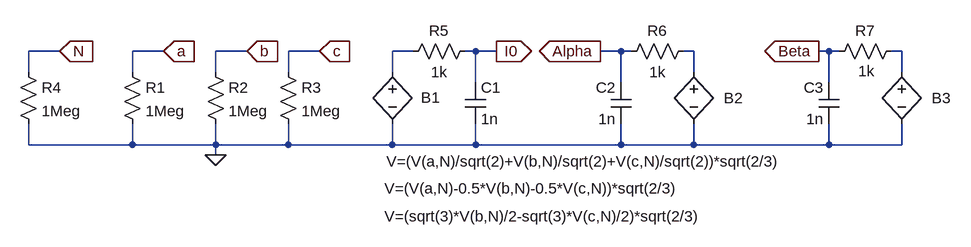
[diagram p0: schematic abc_alpha_beta.asc]
abc_alpha_beta.asc, the LTspice schematic file:
Version 4.1
SHEET 1 1696 680
WIRE -432 16 -480 16
WIRE -272 16 -320 16
WIRE -144 16 -192 16
WIRE -32 16 -80 16
WIRE 112 16 80 16
WIRE 208 16 192 16
WIRE 240 16 208 16
WIRE 432 16 400 16
WIRE 448 16 432 16
WIRE 544 16 528 16
WIRE 752 16 736 16
WIRE 768 16 752 16
WIRE 864 16 848 16
WIRE -480 48 -480 16
WIRE -320 48 -320 16
WIRE -192 48 -192 16
WIRE -80 48 -80 16
WIRE 80 48 80 16
WIRE 544 48 544 16
WIRE 864 48 864 16
WIRE 208 64 208 16
WIRE 432 64 432 16
WIRE 752 64 752 16
WIRE -480 160 -480 128
WIRE -320 160 -320 128
WIRE -320 160 -480 160
WIRE -192 160 -192 128
WIRE -192 160 -320 160
WIRE -80 160 -80 128
WIRE -80 160 -192 160
WIRE 80 160 80 128
WIRE 80 160 -80 160
WIRE 208 160 208 128
WIRE 208 160 80 160
WIRE 432 160 432 128
WIRE 432 160 208 160
WIRE 544 160 544 128
WIRE 544 160 432 160
WIRE 752 160 752 128
WIRE 752 160 544 160
WIRE 864 160 864 128
WIRE 864 160 752 160
WIRE -192 176 -192 160
FLAG -192 176 0
FLAG -272 16 a
IOPIN -272 16 In
FLAG -144 16 b
IOPIN -144 16 In
FLAG -32 16 c
IOPIN -32 16 In
FLAG 240 16 I0
IOPIN 240 16 Out
FLAG 400 16 Alpha
IOPIN 400 16 Out
FLAG 736 16 Beta
IOPIN 736 16 Out
FLAG -432 16 N
IOPIN -432 16 In
SYMBOL res -336 32 R0
SYMATTR InstName R1
SYMATTR Value 1Meg
SYMBOL res -208 32 R0
SYMATTR InstName R2
SYMATTR Value 1Meg
SYMBOL res -96 32 R0
SYMATTR InstName R3
SYMATTR Value 1Meg
SYMBOL bv 80 32 R0
WINDOW 0 44 55 Left 2
WINDOW 3 -9 154 Left 2
SYMATTR InstName B1
SYMATTR Value V=(V(a,N)/sqrt(2)+V(b,N)/sqrt(2)+V(c,N)/sqrt(2))*sqrt(2/3)
SYMBOL bv 544 32 R0
WINDOW 0 46 56 Left 2
WINDOW 3 -476 195 Left 2
SYMATTR InstName B2
SYMATTR Value V=(V(a,N)-0.5*V(b,N)-0.5*V(c,N))*sqrt(2/3)
SYMBOL bv 864 32 R0
WINDOW 0 46 56 Left 2
WINDOW 3 -796 238 Left 2
SYMATTR InstName B3
SYMATTR Value V=(sqrt(3)*V(b,N)/2-sqrt(3)*V(c,N)/2)*sqrt(2/3)
SYMBOL res 208 0 R90
WINDOW 0 0 56 VBottom 2
WINDOW 3 32 56 VTop 2
SYMATTR InstName R5
SYMATTR Value 1k
SYMBOL res 544 0 R90
WINDOW 0 0 56 VBottom 2
WINDOW 3 32 56 VTop 2
SYMATTR InstName R6
SYMATTR Value 1k
SYMBOL res 864 0 R90
WINDOW 0 0 56 VBottom 2
WINDOW 3 31 54 VTop 2
SYMATTR InstName R7
SYMATTR Value 1k
SYMBOL cap 192 64 R0
SYMATTR InstName C1
SYMATTR Value 1n
SYMBOL cap 448 64 M0
SYMATTR InstName C2
SYMATTR Value 1n
SYMBOL cap 768 64 M0
SYMATTR InstName C3
SYMATTR Value 1n
SYMBOL res -496 32 R0
SYMATTR InstName R4
SYMATTR Value 1Meg

The netlist it stands for:
* abc_alpha_beta.asc
R1 a 0 1Meg
R2 b 0 1Meg
R3 c 0 1Meg
B1 N001 0 V=(V(a,N)/sqrt(2)+V(b,N)/sqrt(2)+V(c,N)/sqrt(2))*sqrt(2/3)
B2 N002 0 V=(V(a,N)-0.5*V(b,N)-0.5*V(c,N))*sqrt(2/3)
B3 N003 0 V=(sqrt(3)*V(b,N)/2-sqrt(3)*V(c,N)/2)*sqrt(2/3)
R5 I0 N001 1k
R6 N002 Alpha 1k
R7 N003 Beta 1k
C1 I0 0 1n
C2 Alpha 0 1n
C3 Beta 0 1n
R4 N 0 1Meg
.backanno
.end